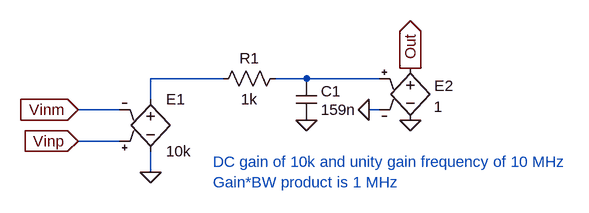
[diagram p0: schematic Gain_BW_op_amp.asc]
Gain_BW_op_amp.asc, the LTspice schematic file:
Version 4
SHEET 1 6300 692
WIRE 1424 288 1360 288
WIRE 1424 336 1360 336
WIRE 1472 272 1472 240
WIRE 1472 384 1472 352
WIRE 1584 240 1472 240
WIRE 1712 240 1664 240
WIRE 1824 240 1712 240
WIRE 1824 288 1808 288
FLAG 1472 384 0
FLAG 1360 288 Vinm
IOPIN 1360 288 In
FLAG 1360 336 Vinp
IOPIN 1360 336 In
FLAG 1872 224 Out
IOPIN 1872 224 Out
FLAG 1712 304 0
FLAG 1808 288 0
FLAG 1872 304 0
SYMBOL e2 1472 256 R0
SYMATTR InstName E1
SYMATTR Value 10k
SYMBOL res 1680 224 R90
WINDOW 0 0 56 VBottom 0
WINDOW 3 32 56 VTop 0
SYMATTR InstName R1
SYMATTR Value 1k
SYMBOL cap 1696 240 R0
WINDOW 0 38 19 Left 0
WINDOW 3 38 48 Left 0
SYMATTR InstName C1
SYMATTR Value 159n
SYMBOL e 1872 208 R0
WINDOW 0 37 43 Left 0
WINDOW 3 36 75 Left 0
SYMATTR InstName E2
SYMATTR Value 1
TEXT 1568 368 Left 0 ;DC gain of 10k and unity gain frequency of 10 MHz\nGain*BW product is 1 MHz

The netlist it stands for:
* Gain_BW_op_amp.asc
E1 N001 0 Vinp Vinm 10k
R1 N002 N001 1k
C1 N002 0 159n
E2 Out 0 N002 0 1
* DC gain of 10k and unity gain frequency of 10 MHz
* Gain*BW product is 1 MHz
.backanno
.end